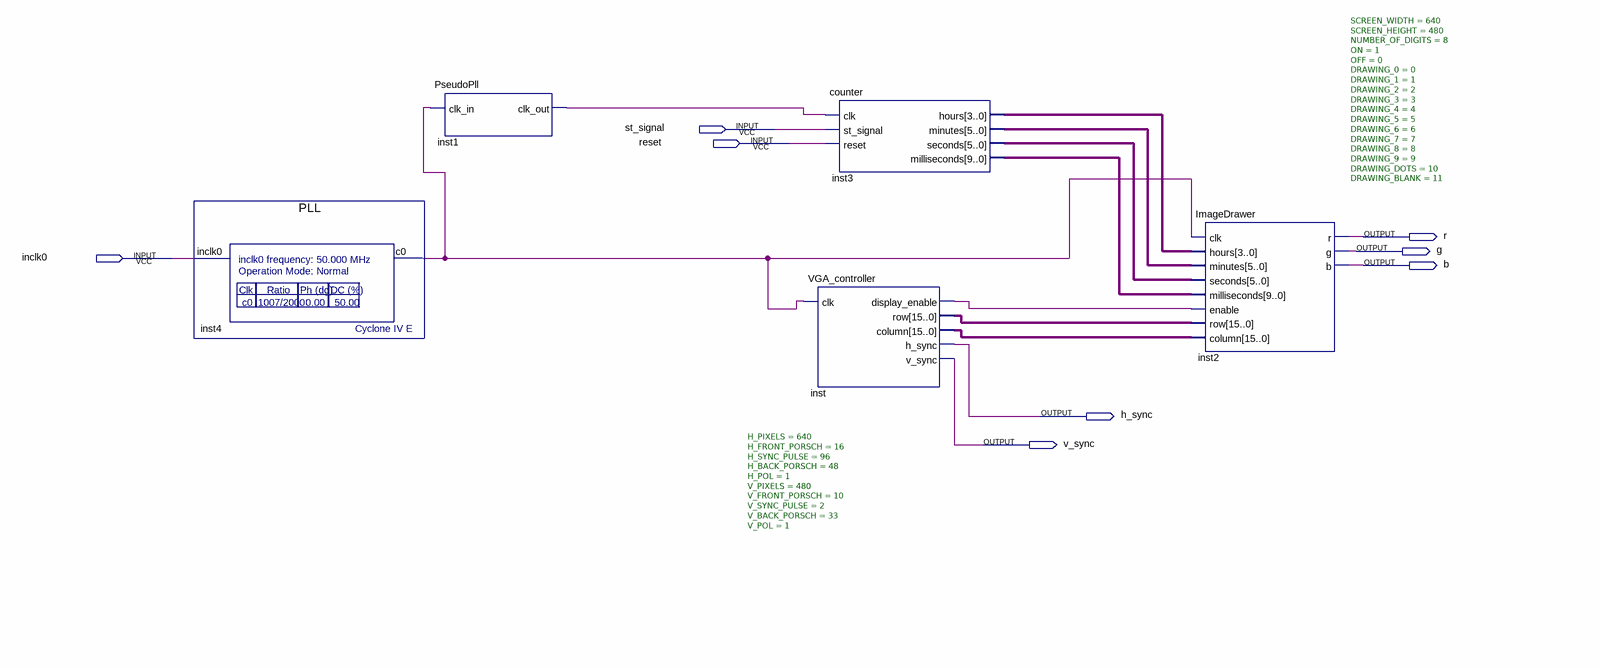
[diagram p0: schematic sheet]
// Quartus schematic main.bdf as structural Verilog: 5 symbols, 8 pins
module main (
  input  st_signal,
  input  reset,
  input  inclk0,
  output r,
  output g,
  output b,
  output h_sync,
  output v_sync
);

  wire inst1_clk_out, inst4_c0, inst_display_enable;
  wire [3:0] inst3_hours;
  wire [5:0] inst3_minutes, inst3_seconds;
  wire [9:0] inst3_milliseconds;
  wire [15:0] inst_column, inst_row;

  PLL inst4 (.inclk0(inclk0), .c0(inst4_c0));
  PseudoPll inst1 (.clk_in(inst4_c0), .clk_out(inst1_clk_out));
  counter inst3 (
    .clk(inst1_clk_out), .st_signal(st_signal), .reset(reset), .hours(inst3_hours), .minutes(inst3_minutes),
    .seconds(inst3_seconds), .milliseconds(inst3_milliseconds));
  VGA_controller #(.H_PIXELS(640), .H_FRONT_PORSCH(16), .H_SYNC_PULSE(96), .H_BACK_PORSCH(48), .H_POL(1), .V_PIXELS(480), .V_FRONT_PORSCH(10), .V_SYNC_PULSE(2), .V_BACK_PORSCH(33), .V_POL(1)) inst (
    .clk(inst4_c0), .display_enable(inst_display_enable), .row(inst_row), .column(inst_column),
    .h_sync(h_sync), .v_sync(v_sync));
  ImageDrawer #(.SCREEN_WIDTH(640), .SCREEN_HEIGHT(480), .NUMBER_OF_DIGITS(8), .ON(1), .OFF(0), .DRAWING_0(0), .DRAWING_1(1), .DRAWING_2(2), .DRAWING_3(3), .DRAWING_4(4), .DRAWING_5(5), .DRAWING_6(6), .DRAWING_7(7), .DRAWING_8(8), .DRAWING_9(9), .DRAWING_DOTS(10), .DRAWING_BLANK(11)) inst2 (
    .clk(inst4_c0), .hours(inst3_hours), .minutes(inst3_minutes), .seconds(inst3_seconds),
    .milliseconds(inst3_milliseconds), .enable(inst_display_enable), .row(inst_row), .column(inst_column),
    .r(r), .g(g), .b(b));
endmodule
